# Altium project Motor_Control_Unit_2023_V1.PrjPcb
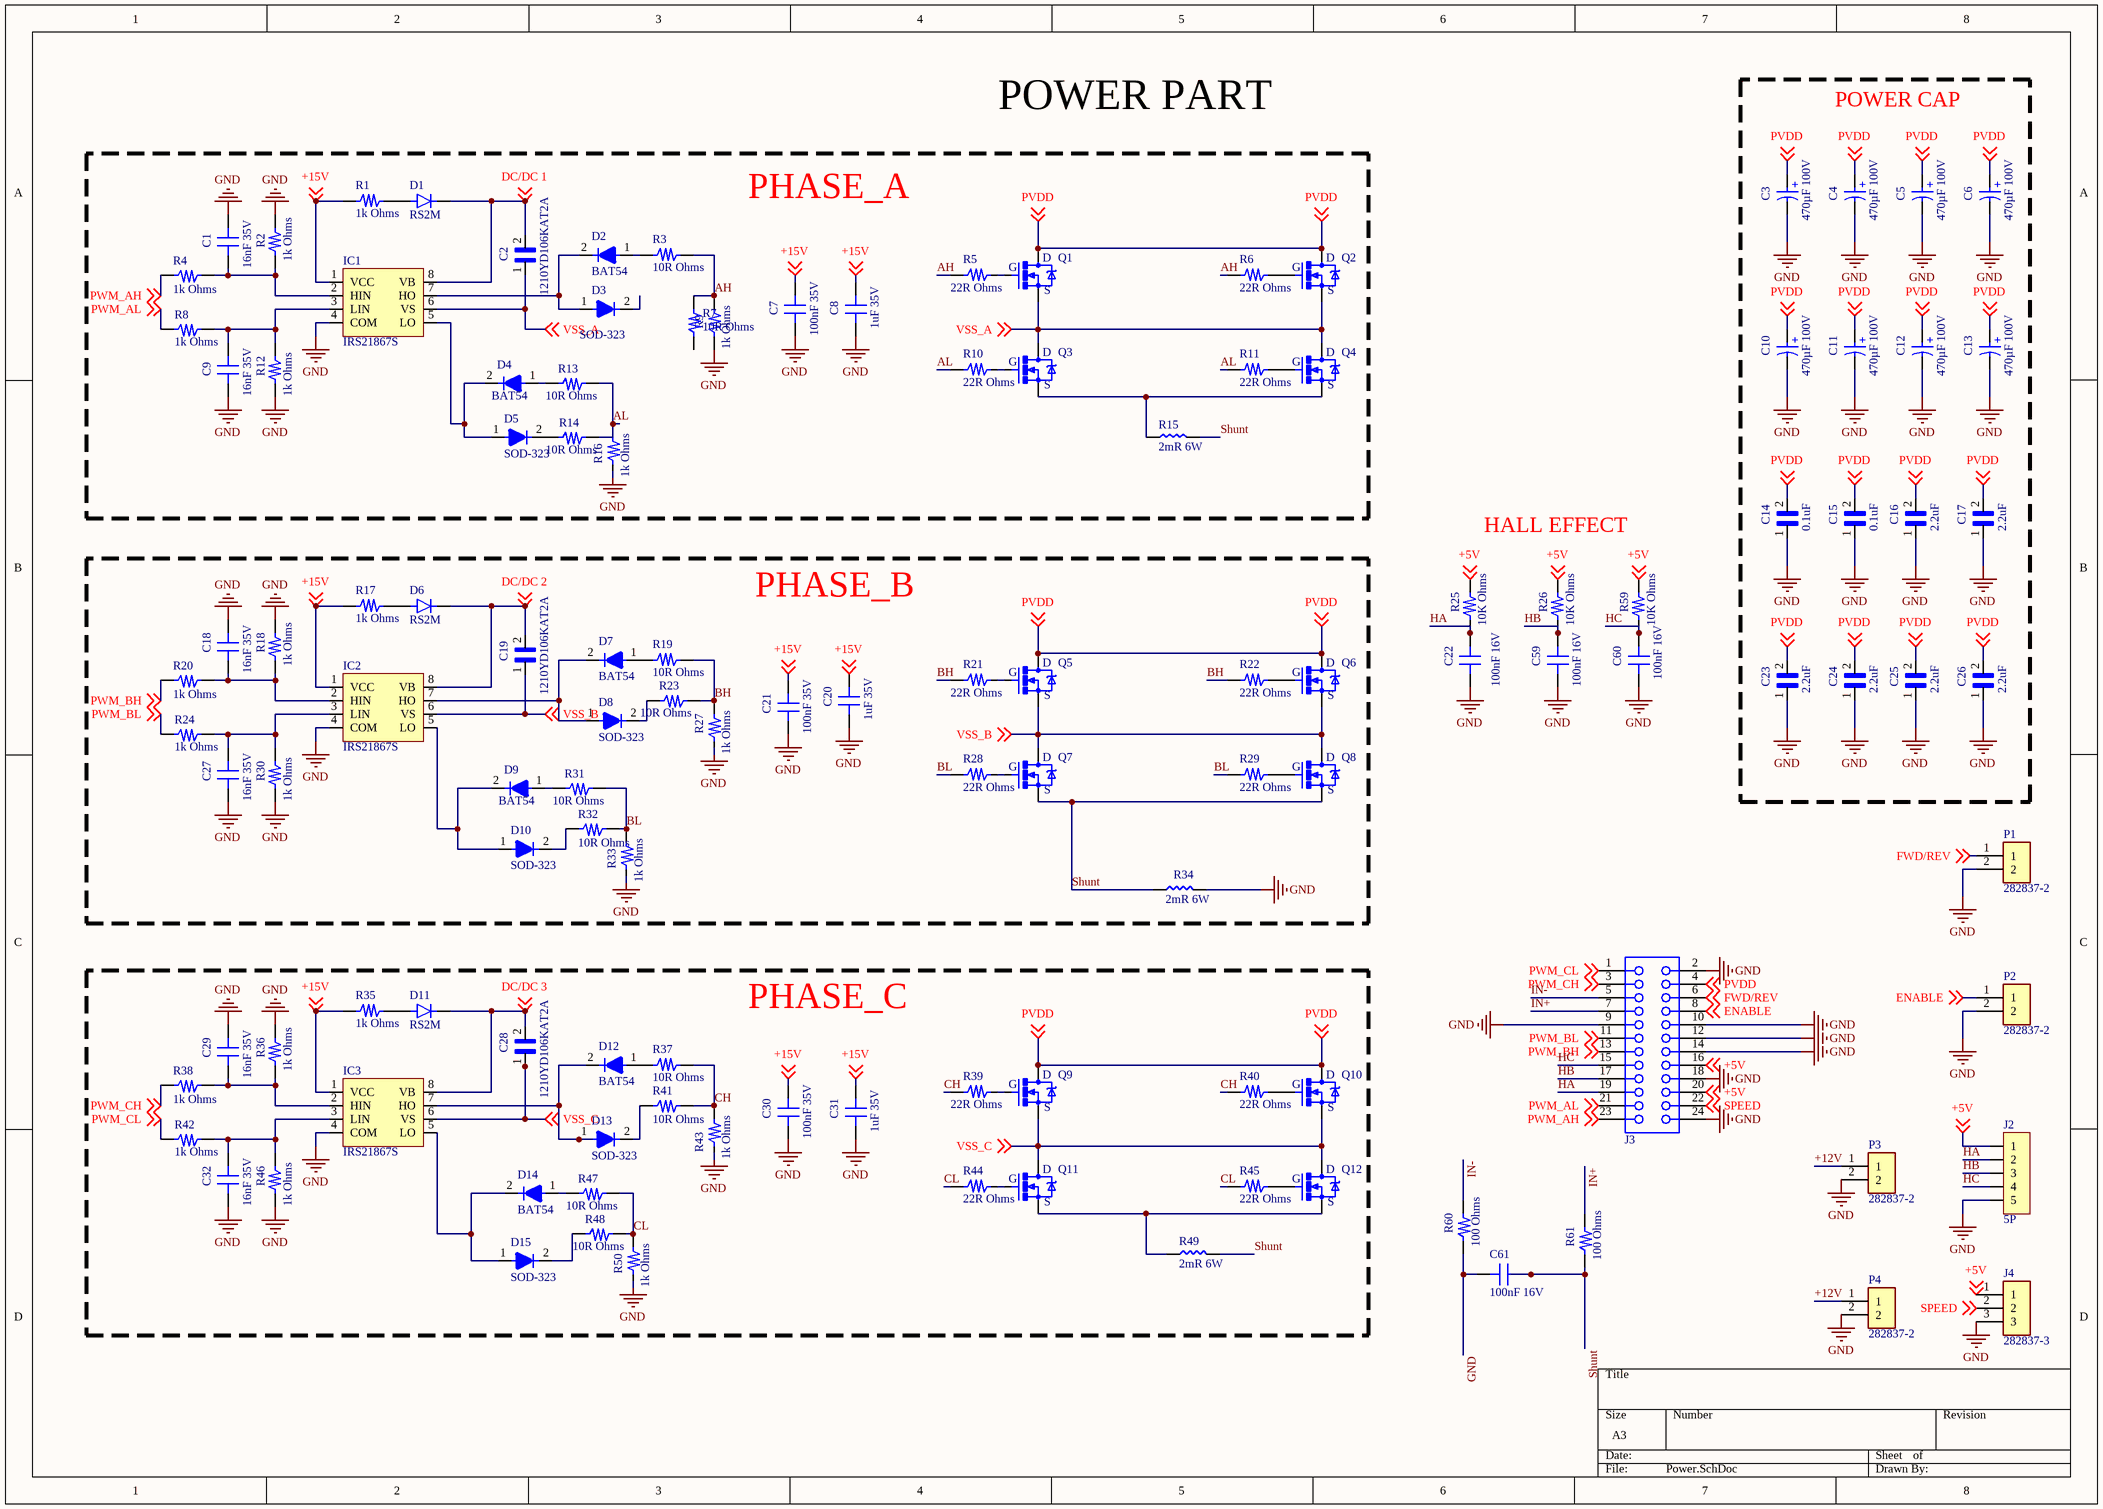
[diagram p0: Power.SchDoc]
2 sheets, 164 parts. Net scope: global (net labels, ports and power ports of the same name join across sheets).
Board file: PCB1.PcbDoc
Sheets:
  Power.SchDoc
  Regulator.SchDoc

## Sheet Power.SchDoc
size A3; SheetNumber: 1; SheetTotal: 2

### Parts
C1  16nF 35V  [0805_CAP]
C2  1210YD106KAT2A  [CAPC3225X279N]
C3  470µF 100V  [WCAP-ATUL_D18H31.5]
C4  470µF 100V  [WCAP-ATUL_D18H31.5]
C5  470µF 100V  [WCAP-ATUL_D18H31.5]
C6  470µF 100V  [WCAP-ATUL_D18H31.5]
C7  100nF 35V  [0805_CAP]
C8  value 1uF 35V  [0805_CAP]  (hidden comment: 10uF)
C9  16nF 35V  [0805_CAP]
C10  470µF 100V  [WCAP-ATUL_D18H31.5]
C11  470µF 100V  [WCAP-ATUL_D18H31.5]
C12  470µF 100V  [WCAP-ATUL_D18H31.5]
C13  470µF 100V  [WCAP-ATUL_D18H31.5]
C14  0.1uF  [CAPC3225X279N]
C15  0.1uF  [CAPC3225X279N]
C16  2.2uF  [CAPC3225X279N]
C17  2.2uF  [CAPC3225X279N]
C18  16nF 35V  [0805_CAP]
C19  1210YD106KAT2A  [CAPC3225X279N]
C20  value 1uF 35V  [0805_CAP]  (hidden comment: 10uF)
C21  100nF 35V  [0805_CAP]
C22  100nF 16V  [0805_CAP]
C23  2.2uF  [CAPC3225X279N]
C24  2.2uF  [CAPC3225X279N]
C25  2.2uF  [CAPC3225X279N]
C26  2.2uF  [CAPC3225X279N]
C27  16nF 35V  [0805_CAP]
C28  1210YD106KAT2A  [CAPC3225X279N]
C29  16nF 35V  [0805_CAP]
C30  100nF 35V  [0805_CAP]
C31  value 1uF 35V  [0805_CAP]  (hidden comment: 10uF)
C32  16nF 35V  [0805_CAP]
C59  100nF 16V  [0805_CAP]
C60  100nF 16V  [0805_CAP]
C61  100nF 16V  [0603_CAP]
D1  RS2M  [DIOM4336X265N]
D2  BAT54  [SOD323]
D3  SOD-323  [SOD323]
D4  BAT54  [SOD323]
D5  SOD-323  [SOD323]
D6  RS2M  [DIOM4336X265N]
D7  BAT54  [SOD323]
D8  SOD-323  [SOD323]
D9  BAT54  [SOD323]
D10  SOD-323  [SOD323]
D11  RS2M  [DIOM4336X265N]
D12  BAT54  [SOD323]
D13  SOD-323  [SOD323]
D14  BAT54  [SOD323]
D15  SOD-323  [SOD323]
IC1  IRS21867S  [IRS21867S]
IC2  IRS21867S  [IRS21867S]
IC3  IRS21867S  [IRS21867S]
J2  5P  [TBLOCK5P]
J3  61302421821  [61302421821]  (value not drawn)
J4  282837-3  [TE_282837-3]
P1  282837-2  [TE_282837-2]
P2  282837-2  [TE_282837-2]
P3  282837-2  [TE_282837-2]
P4  282837-2  [TE_282837-2]
Q1  IXTH200N10T  [TO-247]  (value not drawn)
Q2  IRFP4310ZPbF  [TO-247]  (value not drawn)
Q3  IRFP4310ZPbF  [TO-247]  (value not drawn)
Q4  IRFP4310ZPbF  [TO-247]  (value not drawn)
Q5  IXTH200N10T  [TO-247]  (value not drawn)
Q6  IRFP4310ZPbF  [TO-247]  (value not drawn)
Q7  IRFP4310ZPbF  [TO-247]  (value not drawn)
Q8  IRFP4310ZPbF  [TO-247]  (value not drawn)
Q9  IXTH200N10T  [TO-247]  (value not drawn)
Q10  IRFP4310ZPbF  [TO-247]  (value not drawn)
Q11  IRFP4310ZPbF  [TO-247]  (value not drawn)
Q12  IRFP4310ZPbF  [TO-247]  (value not drawn)
R1  1k Ohms  [0805_RES]
R2  1k Ohms  [0805_RES]
R3  10R Ohms  [0805_RES]
R4  1k Ohms  [0805_RES]
R5  22R Ohms  [0805_RES]
R6  22R Ohms  [0805_RES]
R7  10R Ohms  [0805_RES]
R8  1k Ohms  [0805_RES]
R9  1k Ohms  [0805_RES]
R10  22R Ohms  [0805_RES]
R11  22R Ohms  [0805_RES]
R12  1k Ohms  [0805_RES]
R13  10R Ohms  [0805_RES]
R14  10R Ohms  [0805_RES]
R15  2mR 6W  [3920]
R16  1k Ohms  [0805_RES]
R17  1k Ohms  [0805_RES]
R18  1k Ohms  [0805_RES]
R19  10R Ohms  [0805_RES]
R20  1k Ohms  [0805_RES]
R21  22R Ohms  [0805_RES]
R22  22R Ohms  [0805_RES]
R23  10R Ohms  [0805_RES]
R24  1k Ohms  [0805_RES]
R25  10K Ohms  [0805_RES]
R26  10K Ohms  [0805_RES]
R27  1k Ohms  [0805_RES]
R28  22R Ohms  [0805_RES]
R29  22R Ohms  [0805_RES]
R30  1k Ohms  [0805_RES]
R31  10R Ohms  [0805_RES]
R32  10R Ohms  [0805_RES]
R33  1k Ohms  [0805_RES]
R34  2mR 6W  [3920]
R35  1k Ohms  [0805_RES]
R36  1k Ohms  [0805_RES]
R37  10R Ohms  [0805_RES]
R38  1k Ohms  [0805_RES]
R39  22R Ohms  [0805_RES]
R40  22R Ohms  [0805_RES]
R41  10R Ohms  [0805_RES]
R42  1k Ohms  [0805_RES]
R43  1k Ohms  [0805_RES]
R44  22R Ohms  [0805_RES]
R45  22R Ohms  [0805_RES]
R46  1k Ohms  [0805_RES]
R47  10R Ohms  [0805_RES]
R48  10R Ohms  [0805_RES]
R49  2mR 6W  [3920]
R50  1k Ohms  [0805_RES]
R59  10K Ohms  [0805_RES]
R60  100 Ohms  [0603_RES]
R61  100 Ohms  [0603_RES]

### Blocks framed on the sheet
POWER CAP: C3-C6 C10-C17 C23-C26
PHASE_A: C1 C2 C7-C9 D1-D5 IC1 Q1-Q4 R1-R16
PHASE_B: C18-C21 C27 D6-D10 IC2 Q5-Q8 R17-R24 R27-R34
PHASE_C: C28-C32 D11-D15 IC3 Q9-Q12 R35-R50

### Nets
GND: C1.2 C3.2(N) C4.2(N) C5.2(N) C6.2(N) C7.1 C8.1 C9.1 C10.2(N) C11.2(N) C12.2(N) C13.2(N) C14.1 C15.1 C16.1 C17.1 C18.2 C20.1 C21.1 C22.2 C23.1 C24.1 C25.1 C26.1 C27.1 C29.2 C30.1 C31.1 C32.1 C59.2 C60.1 C61.2 IC1.4(COM) IC2.4(COM) IC3.4(COM) J2.5 J3.2 J3.9 J3.10 J3.12 J3.14 J3.18 J3.24 J4.3 P1.2 P2.2 P3.2 P4.2 R2.2 R9.2 R12.1 R16.2 R18.2 R27.2 R30.1 R33.2 R34.2 R36.2 R43.2 R46.1 R50.2 R60.2
+5V: J2.1 J3.16 J3.20 J4.1 R25.2 R26.2 R59.2 ; off-sheet +5V
+12V: P3.1 P4.1
+15V: C7.2 C8.2 C20.2 C21.2 C30.2 C31.2 IC1.1(VCC) IC2.1(VCC) IC3.1(VCC) R1.1 R17.1 R35.1 ; off-sheet +15V
AH: R3.2 R5.1 R6.1 R7.1 R9.1
AL: R10.1 R11.1 R13.1 R14.1 R16.1
BH: R19.2 R21.1 R22.1 R23.1 R27.1
BL: R28.1 R29.1 R31.1 R32.1 R33.1
CH: R37.2 R39.1 R40.1 R41.1 R43.1
CL: R44.1 R45.1 R47.1 R48.1 R50.1
DC/DC 1: C2.2 D1.C(K) IC1.8(VB) ; off-sheet DC/DC 1
DC/DC 2: C19.2 D6.C(K) IC2.8(VB) ; off-sheet DC/DC 2
DC/DC 3: C28.2 D11.C(K) IC3.8(VB) ; off-sheet DC/DC 3
ENABLE: J3.8 P2.1 ; off-sheet ENABLE
FWD/REV: J3.6 P1.1 ; off-sheet FWD/REV
HA: C22.1 J2.2 J3.19 R25.1
HB: C59.1 J2.3 J3.17 R26.1
HC: C60.2 J2.4 J3.15 R59.1
IN+: J3.7 R61.1
IN-: J3.5 R60.1
PVDD: C3.1(P) C4.1(P) C5.1(P) C6.1(P) C10.1(P) C11.1(P) C12.1(P) C13.1(P) C14.2 C15.2 C16.2 C17.2 C23.2 C24.2 C25.2 C26.2 J3.4 Q1.2(D) Q2.2(D) Q5.2(D) Q6.2(D) Q9.2(D) Q10.2(D) ; off-sheet PVDD
PWM_AH: J3.23 R4.2 ; off-sheet PWM_AH
PWM_AL: J3.21 R8.2 ; off-sheet PWM_AL
PWM_BH: J3.13 R20.2 ; off-sheet PWM_BH
PWM_BL: J3.11 R24.2 ; off-sheet PWM_BL
PWM_CH: J3.3 R38.2 ; off-sheet PWM_CH
PWM_CL: J3.1 R42.2 ; off-sheet PWM_CL
Shunt: C61.1 Q7.3(S) Q8.3(S) R15.2 R34.1 R49.2 R61.2
SPEED: J3.22 J4.2 ; off-sheet SPEED
VSS_A: C2.1 IC1.6(VS) Q1.3(S) Q2.3(S) Q3.2(D) Q4.2(D) ; off-sheet VSS_A
VSS_B: C19.1 IC2.6(VS) Q5.3(S) Q6.3(S) Q7.2(D) Q8.2(D) ; off-sheet VSS_B
VSS_C: C28.1 IC3.6(VS) Q9.3(S) Q10.3(S) Q11.2(D) Q12.2(D) ; off-sheet VSS_C
NetC1_1: C1.1 IC1.2(HIN) R2.1 R4.1
NetC9_2: C9.2 IC1.3(LIN) R8.1 R12.2
NetC18_1: C18.1 IC2.2(HIN) R18.1 R20.1
NetC27_2: C27.2 IC2.3(LIN) R24.1 R30.2
NetC29_1: C29.1 IC3.2(HIN) R36.1 R38.1
NetC32_2: C32.2 IC3.3(LIN) R42.1 R46.2
NetD1_A: D1.A R1.2
NetD2_1: D2.1 R3.1
NetD2_2: D2.2 D3.1 IC1.7(HO)
NetD4_1: D4.1 R13.2
NetD4_2: D4.2 D5.1 IC1.5(LO)
NetD5_2: D5.2 R14.2
NetD6_A: D6.A R17.2
NetD7_1: D7.1 R19.1
NetD7_2: D7.2 D8.1 IC2.7(HO)
NetD8_2: D8.2 R23.2
NetD9_1: D9.1 R31.2
NetD9_2: D9.2 D10.1 IC2.5(LO)
NetD10_2: D10.2 R32.2
NetD11_A: D11.A R35.2
NetD12_1: D12.1 R37.1
NetD12_2: D12.2 D13.1 IC3.7(HO)
NetD13_2: D13.2 R41.2
NetD14_1: D14.1 R47.2
NetD14_2: D14.2 D15.1 IC3.5(LO)
NetD15_2: D15.2 R48.2
NetQ1_1: Q1.1(G) R5.2
NetQ2_1: Q2.1(G) R6.2
NetQ3_1: Q3.1(G) R10.2
NetQ3_3: Q3.3(S) Q4.3(S) R15.1
NetQ4_1: Q4.1(G) R11.2
NetQ5_1: Q5.1(G) R21.2
NetQ6_1: Q6.1(G) R22.2
NetQ7_1: Q7.1(G) R28.2
NetQ8_1: Q8.1(G) R29.2
NetQ9_1: Q9.1(G) R39.2
NetQ10_1: Q10.1(G) R40.2
NetQ11_1: Q11.1(G) R44.2
NetQ11_3: Q11.3(S) Q12.3(S) R49.1
NetQ12_1: Q12.1(G) R45.2

Not connected (* = marked no-connect by the designer): D3 2(0); R7 2

### Notes on the sheet
- POWER PART
- HALL EFFECT
- (in symbol 860040881012) +

### Library data of the parts
C1 C7-C9 C18 C20-C22 C27 C29-C32 C59 C60 = CAP_0805
  C1 C9 C18 C27 C29 C32: Value: 16nF 35V
  C7 C21 C30: Value: 100nF 35V
  C22 C59 C60: Value: 100nF 16V
C2 C14-C17 C19 C23-C26 C28 = 1210YD106KAT2A: Cap Ceramic 10uF 16V X5R 10% SMD 1210 85Â°C Embossed T/R; Package: None; Price: None; Value: *; MP: 1210YD106KAT2A; Availability: Unavailable
C3-C6 C10-C13 = 860040881012: WCAP-ATUL Aluminum Electrolytic Capacitor, Radial, THT, D18 x H31.5mm, 470µF, 100V; Manufacturer: Wurth Elektronik; Capacitance Tolerance: 20%; Dissipation Factor: 9%; Endurance: 10000h; Leakage Current: 470µA; Ripple Current: 1600mA; Technical Reference: ATDL315471M100DSPAEK000; Manufacturer Part Number: 860040881012; Category: Aluminum Electrolytic Capacitors; Match Code: WCAP-ATUL; ComponentLink1Description: Website Link; ComponentLink1URL: https://www.we-online.com/redexpert/article/860040881012?ad; ComponentLink2Description: Datasheet Link; ComponentLink2URL: https://www.we-online.com/redexpert/spec/860040881012?ad; Mount: Through Hole; Operating Temperature Max: 105°C; Operating Temperature Min: -40°C; Packaging: Ammo Pack; Height: 31.5mm; Diameter: 18mm; Capacitance: 470µF 100V; Rated Voltage (DC): 100V
C61 = CAP_0603: CL10B105KO8NNNC - MLCC (1608) 0603 1uF 16VDC ±10% X7R; Value: 100nF 16V
D1 D6 D11 = RS2M: 2A, 50V - 1000V Fast Recovery Surface Mount Rectifier; MF: Taiwan Semiconductor; Package: DO-214AA-2 Taiwan Semiconductor; Price: None; Value: *; SnapEDA_Link: https://www.snapeda.com/parts/RS2M/Taiwan+Semiconductor/view-part/?ref=snap; MP: RS2M; Availability: In Stock; Check_prices: https://www.snapeda.com/parts/RS2M/Taiwan+Semiconductor/view-part/?ref=eda
D2-D5 D7-D10 D12-D15 = diode/sod323
J2 = TBLOCK5P
J3 = 61302421821: WR-PHD Socket Header, THT, Vertical, pitch 2.54mm, 2 Row, 24P; Manufacturer: Wurth Elektronik; Contact Resistance: 20mOhm; Rated Current: 3A; Working Voltage: 250V; Withstanding Voltage: 500V; Manufacturer Part Number: 61302421821; Category: Board-to-Board Connectors; Match Code: WR-PHD; ComponentLink1Description: Website Link; ComponentLink1URL: https://www.we-online.com/redexpert/article/61302421821?ad; ComponentLink2Description: Datasheet Link; ComponentLink2URL: https://www.we-online.com/redexpert/spec/61302421821?ad; Mount: Through Hole; Operating Temperature Max: 125°C; Operating Temperature Min: -40°C; Packaging: Tray; Gender: Socket Header; Number of Pins: 24; Number of Rows: 2; Orientation: Vertical; Pitch: 2.54mm
J4 = 282837-3: TERMI-BLOK PCB MOUNT 3P; Availability: Unavailable; Package: None; MP: 282837-3; Value: *; Price: None
P1-P4 = 282837-2: Ð Ð°Ð·ÑŠÐµÐ¼Ð½Ñ‹Ðµ ÐºÐ»ÐµÐ¼Ð¼Ð½Ñ‹Ðµ ÐºÐ¾Ð»Ð¾Ð´ÐºÐ¸ Ð Ð¾Ð·ÐµÑ‚ÐºÐ° 2 Ð¿Ð¾Ð»Ð¾Ð¶ÐµÐ½Ð¸Ñ 5,08 Ð¼Ð¼ ÐŸÑ€Ð¸Ð¿Ð¾Ð¹ Ð¿Ñ€ÑÐ¼Ð¾Ð¹ Ñ‡ÐµÑ€ÐµÐ· Ð¾Ñ‚Ð²ÐµÑ€ÑÑ‚Ð¸Ðµ 13,5 Ð / ÐºÐ¾Ð½Ñ‚Ð°ÐºÑ‚; MF: TE Connectivity; SnapEDA_Link: https://www.snapeda.com/parts/282837-2/TE+Connectivity+AMP+Connectors/view-part/?ref=snap; Price: None; Check_prices: https://www.snapeda.com/parts/282837-2/TE+Connectivity+AMP+Connectors/view-part/?ref=eda; Purchase-URL: https://pricing.snapeda.com/search/part/282837-2/?ref=eda; MP: 282837-2; Value: *; Availability: In Stock; Package: None
Q1-Q12 = IRFP4310ZPbF: IRFP4310ZPBF - MOSFET DIS.120A 100V N-CH TO247AC HEXFET THT; Current Rate: 120A; Voltage Rate: 100V; ComponentLink1Description: Özdisan; ComponentLink1URL: https://ozdisan.com/Product/Detail/480417/IRFP4310ZPBF; ComponentLink2Description: Datasheet; ComponentLink2URL: https://cdn.ozdisan.com/ETicaret_Dosya/480417_1248700.pdf
  Q1 Q5 Q9: PartValue: IXTH200N10T
  Q2-Q4 Q6-Q8 Q10-Q12: PartValue: IRFP4310ZPbF
R1-R6 R8-R13 R16-R22 R24 R27-R31 R33 R35-R40 R42-R47 R50 = RES_0805: 0805; Power: 1/8 W
  R1 R2 R4 R8 R9 R12 R16-R18 R20 R24 R27 R30 R33 R35 R36 R38 R42 R43 R46 R50: Value: 1k Ohms
  R3 R13 R19 R31 R37 R47: Value: 10R Ohms
  R5 R6 R10 R11 R21 R22 R28 R29 R39 R40 R44 R45: Value: 22R Ohms
R7 R14 R23 R25 R26 R32 R41 R48 R59 = RES_0805: 0805; Value: 1k Ohms; Power: 1/8 W
R15 R34 R49 = Shunt: 3920
R60 R61 = RES_0603: 0603; Value: 82 Ohms; Power: 1/8W

## Sheet Regulator.SchDoc
size 381 x 203 mm; SheetNumber: 2; SheetTotal: 2; SPICEModelCacheNBKOHBQZ: <root> / <DocumentId>NBKOHBQZ</DocumentId> / </root>
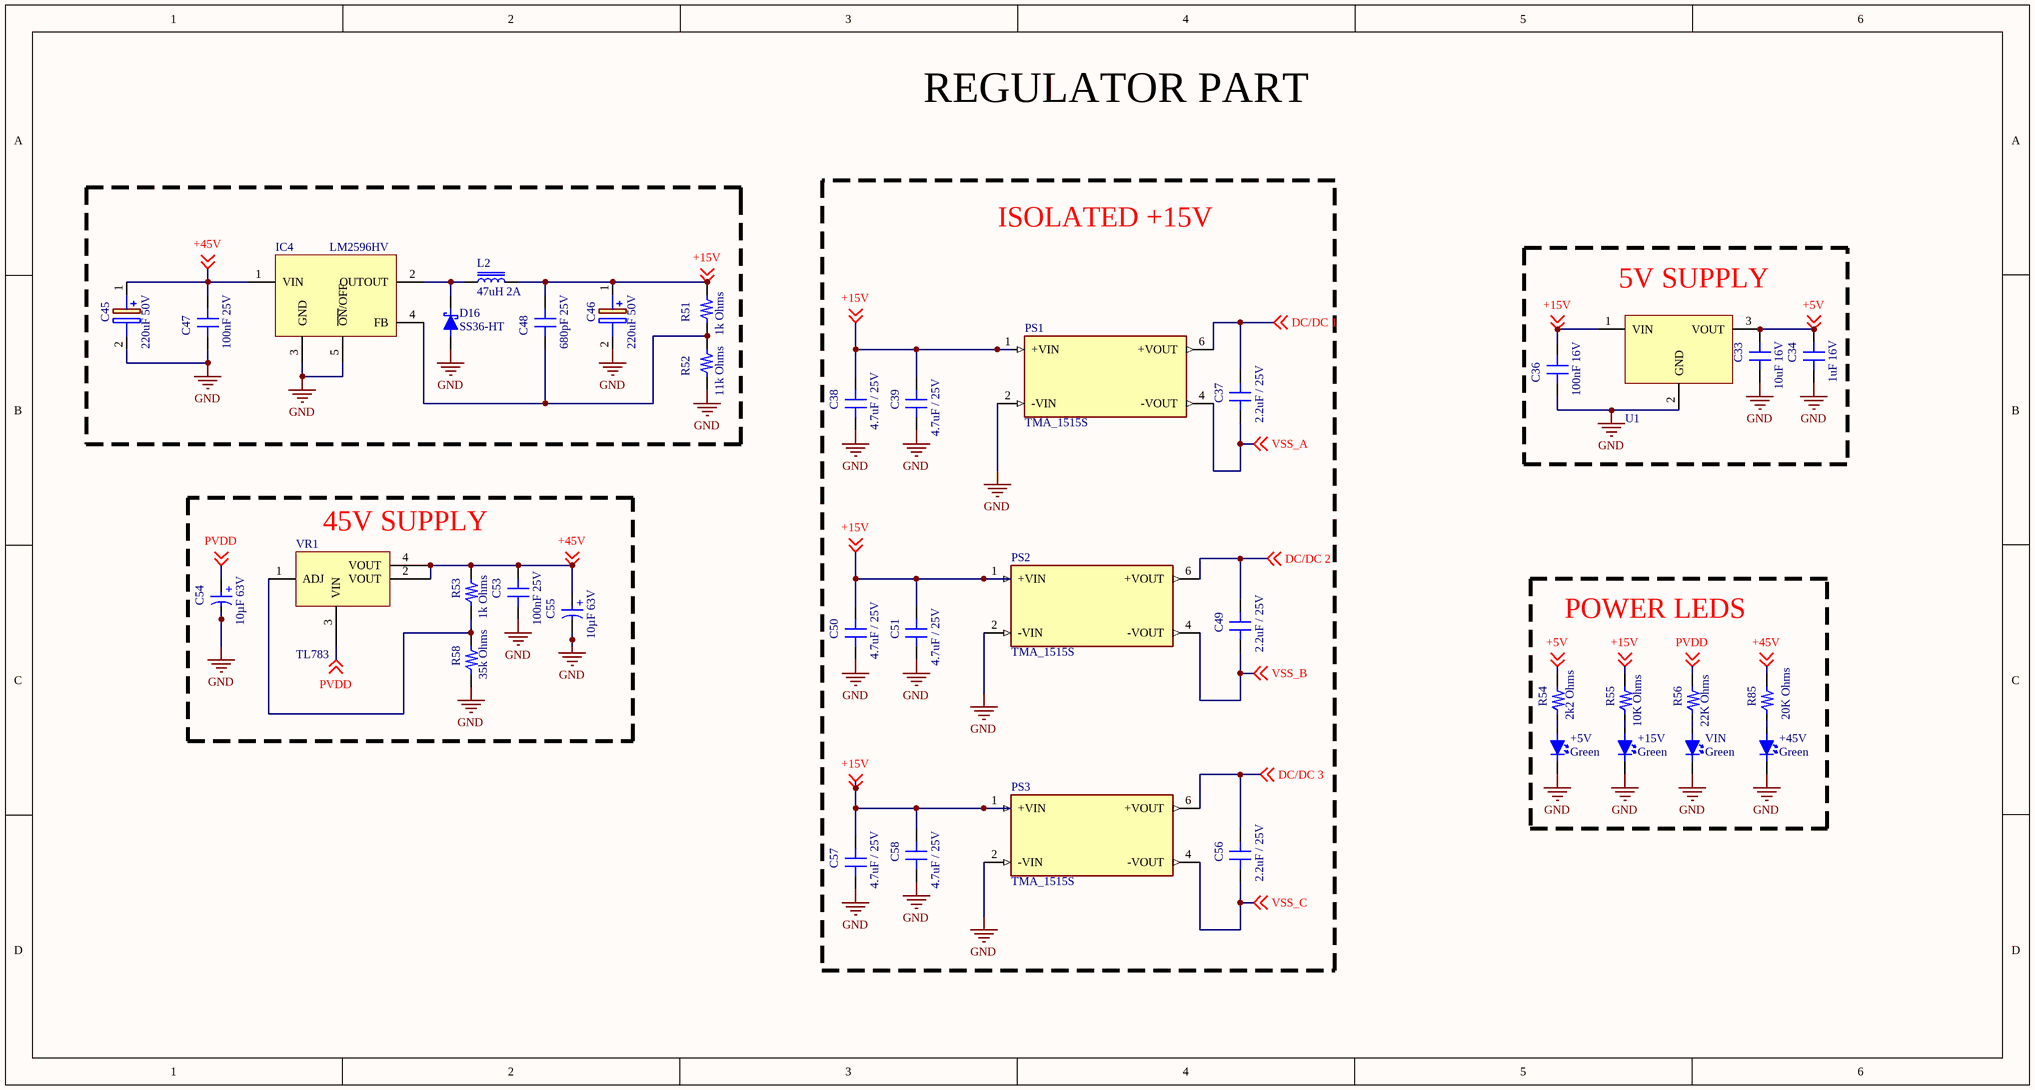
[diagram p1: Regulator.SchDoc]

### Parts
+5V  Green  [0805LED]
+15V  Green  [0805LED]
+45V  Green  [0805LED]
C33  10uF 16V  [0805_CAP]
C34  1uF 16V  [0805_CAP]
C36  100nF 16V  [0805_CAP]
C37  2.2uF / 25V  [0805_CAP]
C38  4.7uF / 25V  [0805_CAP]
C39  4.7uF / 25V  [0805_CAP]
C45  220uF 50V  [CAPAE1030X1060N]
C46  220uF 50V  [CAPAE1030X1060N]
C47  100nF 25V  [0805_CAP]
C48  680pF 25V  [0805_CAP]
C49  2.2uF / 25V  [0805_CAP]
C50  4.7uF / 25V  [0805_CAP]
C51  4.7uF / 25V  [0805_CAP]
C53  100nF 25V  [0805_CAP]
C54  10µF 63V  [WCAP-ATG5_D5H11]
C55  10µF 63V  [WCAP-ATG5_D5H11]
C56  2.2uF / 25V  [0805_CAP]
C57  4.7uF / 25V  [0805_CAP]
C58  4.7uF / 25V  [0805_CAP]
D16  SS36-HT  [DO-214AB]
IC4  LM2596HV  [TO-263-5]
L2  47uH 2A  [BOURNS SRR1280]
PS1  TMA_1515S  [CONV_TMA_1515S]
PS2  TMA_1515S  [CONV_TMA_1515S]
PS3  TMA_1515S  [CONV_TMA_1515S]
R51  1k Ohms  [0805_RES]
R52  11k Ohms  [0805_RES]
R53  1k Ohms  [0805_RES]
R54  2k2 Ohms  [0805_RES]
R55  10K Ohms  [0805_RES]
R56  22K Ohms  [0805_RES]
R58  35k Ohms  [0805_RES]
R85  20K Ohms  [0805_RES]
U1  8-28Vin, 5Vout, 1Aout  [WPME-FDSM_SIP-3_L11.6W8.5H10.5]  (value not drawn)
VIN  Green  [0805LED]
VR1  TL783  [TL783]

### Blocks framed on the sheet
ISOLATED +15V: C37-C39 C49-C51 C56-C58 PS1-PS3
45V SUPPLY: C53-C55 R53 R58 VR1
POWER LEDS: +5V +15V +45V R54-R56 R85 VIN

### Nets
GND: +5V.2(Cathode(-)) +15V.2(Cathode(-)) +45V.2(Cathode(-)) C33.1 C34.1 C36.1 C38.1 C39.1 C45.2(-) C46.2(-) C47.1 C50.1 C51.1 C53.1 C54.2(N) C55.2(N) C57.1 C58.1 D16.1 IC4.3(GND) IC4.5(~{ON}/OFF) PS1.2(-VIN) PS2.2(-VIN) PS3.2(-VIN) R52.1 R58.2 U1.2(GND) VIN.2(Cathode(-))
+5V: C33.2 C34.2 R54.1 U1.3(VOUT) ; off-sheet +5V
+15V: C36.2 C38.2 C39.2 C46.1(+) C48.2 C50.2 C51.2 C57.2 C58.2 L2.2 PS1.1(+VIN) PS2.1(+VIN) PS3.1(+VIN) R51.2 R55.1 U1.1(VIN) ; off-sheet +15V
+45V: C45.1(+) C47.2 C53.2 C55.1(P) IC4.1(VIN) R53.1 R85.1 VR1.2(VOUT) VR1.4(VOUT) ; off-sheet +45V
DC/DC 1: C37.2 PS1.6(+VOUT) ; off-sheet DC/DC 1
DC/DC 2: C49.2 PS2.6(+VOUT) ; off-sheet DC/DC 2
DC/DC 3: C56.2 PS3.6(+VOUT) ; off-sheet DC/DC 3
PVDD: C54.1(P) R56.1 VR1.3(VIN) ; off-sheet PVDD
VSS_A: C37.1 PS1.4(-VOUT) ; off-sheet VSS_A
VSS_B: C49.1 PS2.4(-VOUT) ; off-sheet VSS_B
VSS_C: C56.1 PS3.4(-VOUT) ; off-sheet VSS_C
Net+5V_1: +5V.1(Anode(+)) R54.2
Net+15V_1: +15V.1(Anode(+)) R55.2
Net+45V_1: +45V.1(Anode(+)) R85.2
NetC48_1: C48.1 IC4.4(FB) R51.1 R52.2
NetD16_2: D16.2 IC4.2(OUTOUT) L2.1
NetR53_2: R53.2 R58.1 VR1.1(ADJ)
NetR56_2: R56.2 VIN.1(Anode(+))

### Notes on the sheet
- REGULATOR PART
- (near U1) 5V SUPPLY
- (in symbol 860020772010) +

### Library data of the parts
+5V +15V +45V VIN = LED: 0805
C33 C34 C36 C47 C48 C53 = CAP_0805
  C33: Value: 10uF 16V
  C34: Value: 1uF 16V
  C36: Value: 100nF 16V
  C47 C53: Value: 100nF 25V
  C48: Value: 680pF 25V
C37-C39 C49-C51 C56-C58 = CAP_0805: Value: 100nF 25V
C45 C46 = CK1H221M-CRG10: Capacitor Polarised; Manufacturer_Name: SEMTECH; Datasheet Link: https://datasheet.lcsc.com/szlcsc/1810281207_ST-Semtech-CK1H221M-CRG10_C131159.pdf; Height: 10.6mm; Manufacturer_Part_Number: CK1H221M-CRG10
C54 C55 = 860020772010: WCAP-ATG5 Aluminum Electrolytic Capacitor, Radial, THT, D5 x H11mm, 10µF, 63V; Manufacturer: Wurth Elektronik; Capacitance Tolerance: +/-20%; Dissipation Factor: 9%; Endurance: 2000h; Leakage Current: 6.3µA; Ripple Current: 42mA; Technical Reference: ATDC110100M063DSPA3B000; Manufacturer Part Number: 860020772010; Category: Aluminum Electrolytic Capacitors; Match Code: WCAP-ATG5; ComponentLink1Description: Website Link; ComponentLink1URL: https://www.we-online.com/redexpert/article/860020772010?ad; ComponentLink2Description: Datasheet Link; ComponentLink2URL: https://www.we-online.com/redexpert/spec/860020772010?ad; Mount: Through Hole; Operating Temperature Max: 105°C; Operating Temperature Min: -40°C; Packaging: Ammo Pack; Height: 11mm; Diameter: 5mm; Rated Voltage (DC): 63V; Capacitance: 10µF 63V
D16 = SS36-214AB-HT: Schottky Diode; ComponentLink1Description: Özdisan; ComponentLink1URL: https://ozdisan.com/guc-yari-iletkenleri/diyotlar-modul-diyotlar-ve-dogrultucular/schottky-diyotlar/SS36-214AB-HT/475999; ComponentLink2Description: Datasheet; ComponentLink2URL: https://cdn.ozdisan.com/ETicaret_Dosya/475999_7494647.pdf; PartNumber: SS36-HT
IC4 = LM2596HV: Integrated Circuit; Manufacturer_Name: Texas Instruments; Datasheet Link: http://www.ti.com/lit/ds/symlink/lm2596.pdf; PartValue: LM2596HV; Mouser Part Number: 926-LM2596S-12; Mouser Price/Stock: https://www.mouser.co.uk/ProductDetail/Texas-Instruments/LM2596S-12?qs=X1J7HmVL2ZEK1FPBBSYJCA%3D%3D; Arrow Part Number: LM2596S-12; Arrow Price/Stock: https://www.arrow.com/en/products/lm2596s-12/texas-instruments
L2 = Inductor: FIXED IND 47UH 2.9A 80 MOHM SMD; Value: 47uH 2A
PS1-PS3 = TMA_1515S: MF: {'manufacturer': u'Traco Power'}; Package: None; Price: None; Value: *; MP: TMA_1515S; Availability: Unavailable
R51 = RES_0805: 0805; Value: 11k Ohms; Power: 1/8 W
R52 = RES_0805: 0805; Value: 1k Ohms; Power: 1/8 W
R53-R56 R58 R85 = RES_0805: 0805; Power: 1/8 W
  R53: Value: 1k Ohms
  R54: Value: 2k2 Ohms
  R55: Value: 10K Ohms
  R56: Value: 22K Ohms
  R58: Value: 35k Ohms
  R85: Value: 20K Ohms
U1 = 173010578: WPME-FDSM Fixed Step Down Regulator Module, THT, SIP-3, 8-28Vin, 5Vout, 1Aout; Manufacturer: Wurth Elektronik; Input Voltage Min: 8V; Input Voltage Max: 28V; Output Current: 1A; Output Voltage: 5V; Manufacturer Part Number: 173010578; Category: Step Down Converter; Match Code: WPME-FDSM; ComponentLink1Description: Website Link; ComponentLink1URL: https://www.we-online.com/redexpert/article/173010578?ad; ComponentLink2Description: Datasheet Link; ComponentLink2URL: https://www.we-online.com/redexpert/spec/173010578?ad; Mount: Through Hole; Operating Temperature Max: 85°C; Operating Temperature Min: -40°C; Packaging: Tube; Case/Size Code: SIP-3; Length: 11.6mm; Width: 8.5mm; Height: 10.5mm
VR1 = TL783/SMD

## Nets that join several sheets
GND: Power (62 pins), Regulator (28 pins)
+5V: Power (7 pins), Regulator (C33.2 C34.2 R54.1 U1.3)
+15V: Power (12 pins), Regulator (16 pins)
DC/DC 1: Power (C2.2 D1.C IC1.8), Regulator (C37.2 PS1.6)
DC/DC 2: Power (C19.2 D6.C IC2.8), Regulator (C49.2 PS2.6)
DC/DC 3: Power (C28.2 D11.C IC3.8), Regulator (C56.2 PS3.6)
PVDD: Power (23 pins), Regulator (C54.1 R56.1 VR1.3)
VSS_A: Power (6 pins), Regulator (C37.1 PS1.4)
VSS_B: Power (6 pins), Regulator (C49.1 PS2.4)
VSS_C: Power (6 pins), Regulator (C56.1 PS3.4)